# Altium schematic sheet 7_SARADC_GPIO.schdoc
size 431 x 309 mm; Symbol: Sheet-Symbol_A4; Device: Sheet-Symbol_A4; Company: 嘉立创EDA; Version: V1.0; Page Size: A4; @Project Name: RK3568核心板; @Page Count: 14; @Update Date: 2024-10-11; @Create Date: 2024-10-09; @Schematic Name: Schematic1; @Page No: 7; @Page Name: SARADC/GPIO; @Board Name: Board1; @Create Time: 17:26:00; @Update Time: 10:52:44; Width: 1655; Height: 1170; Region Start: 1; X Region Count: 6; Y Region Count: 4; Blade Width: 10; Title Block Position: 3
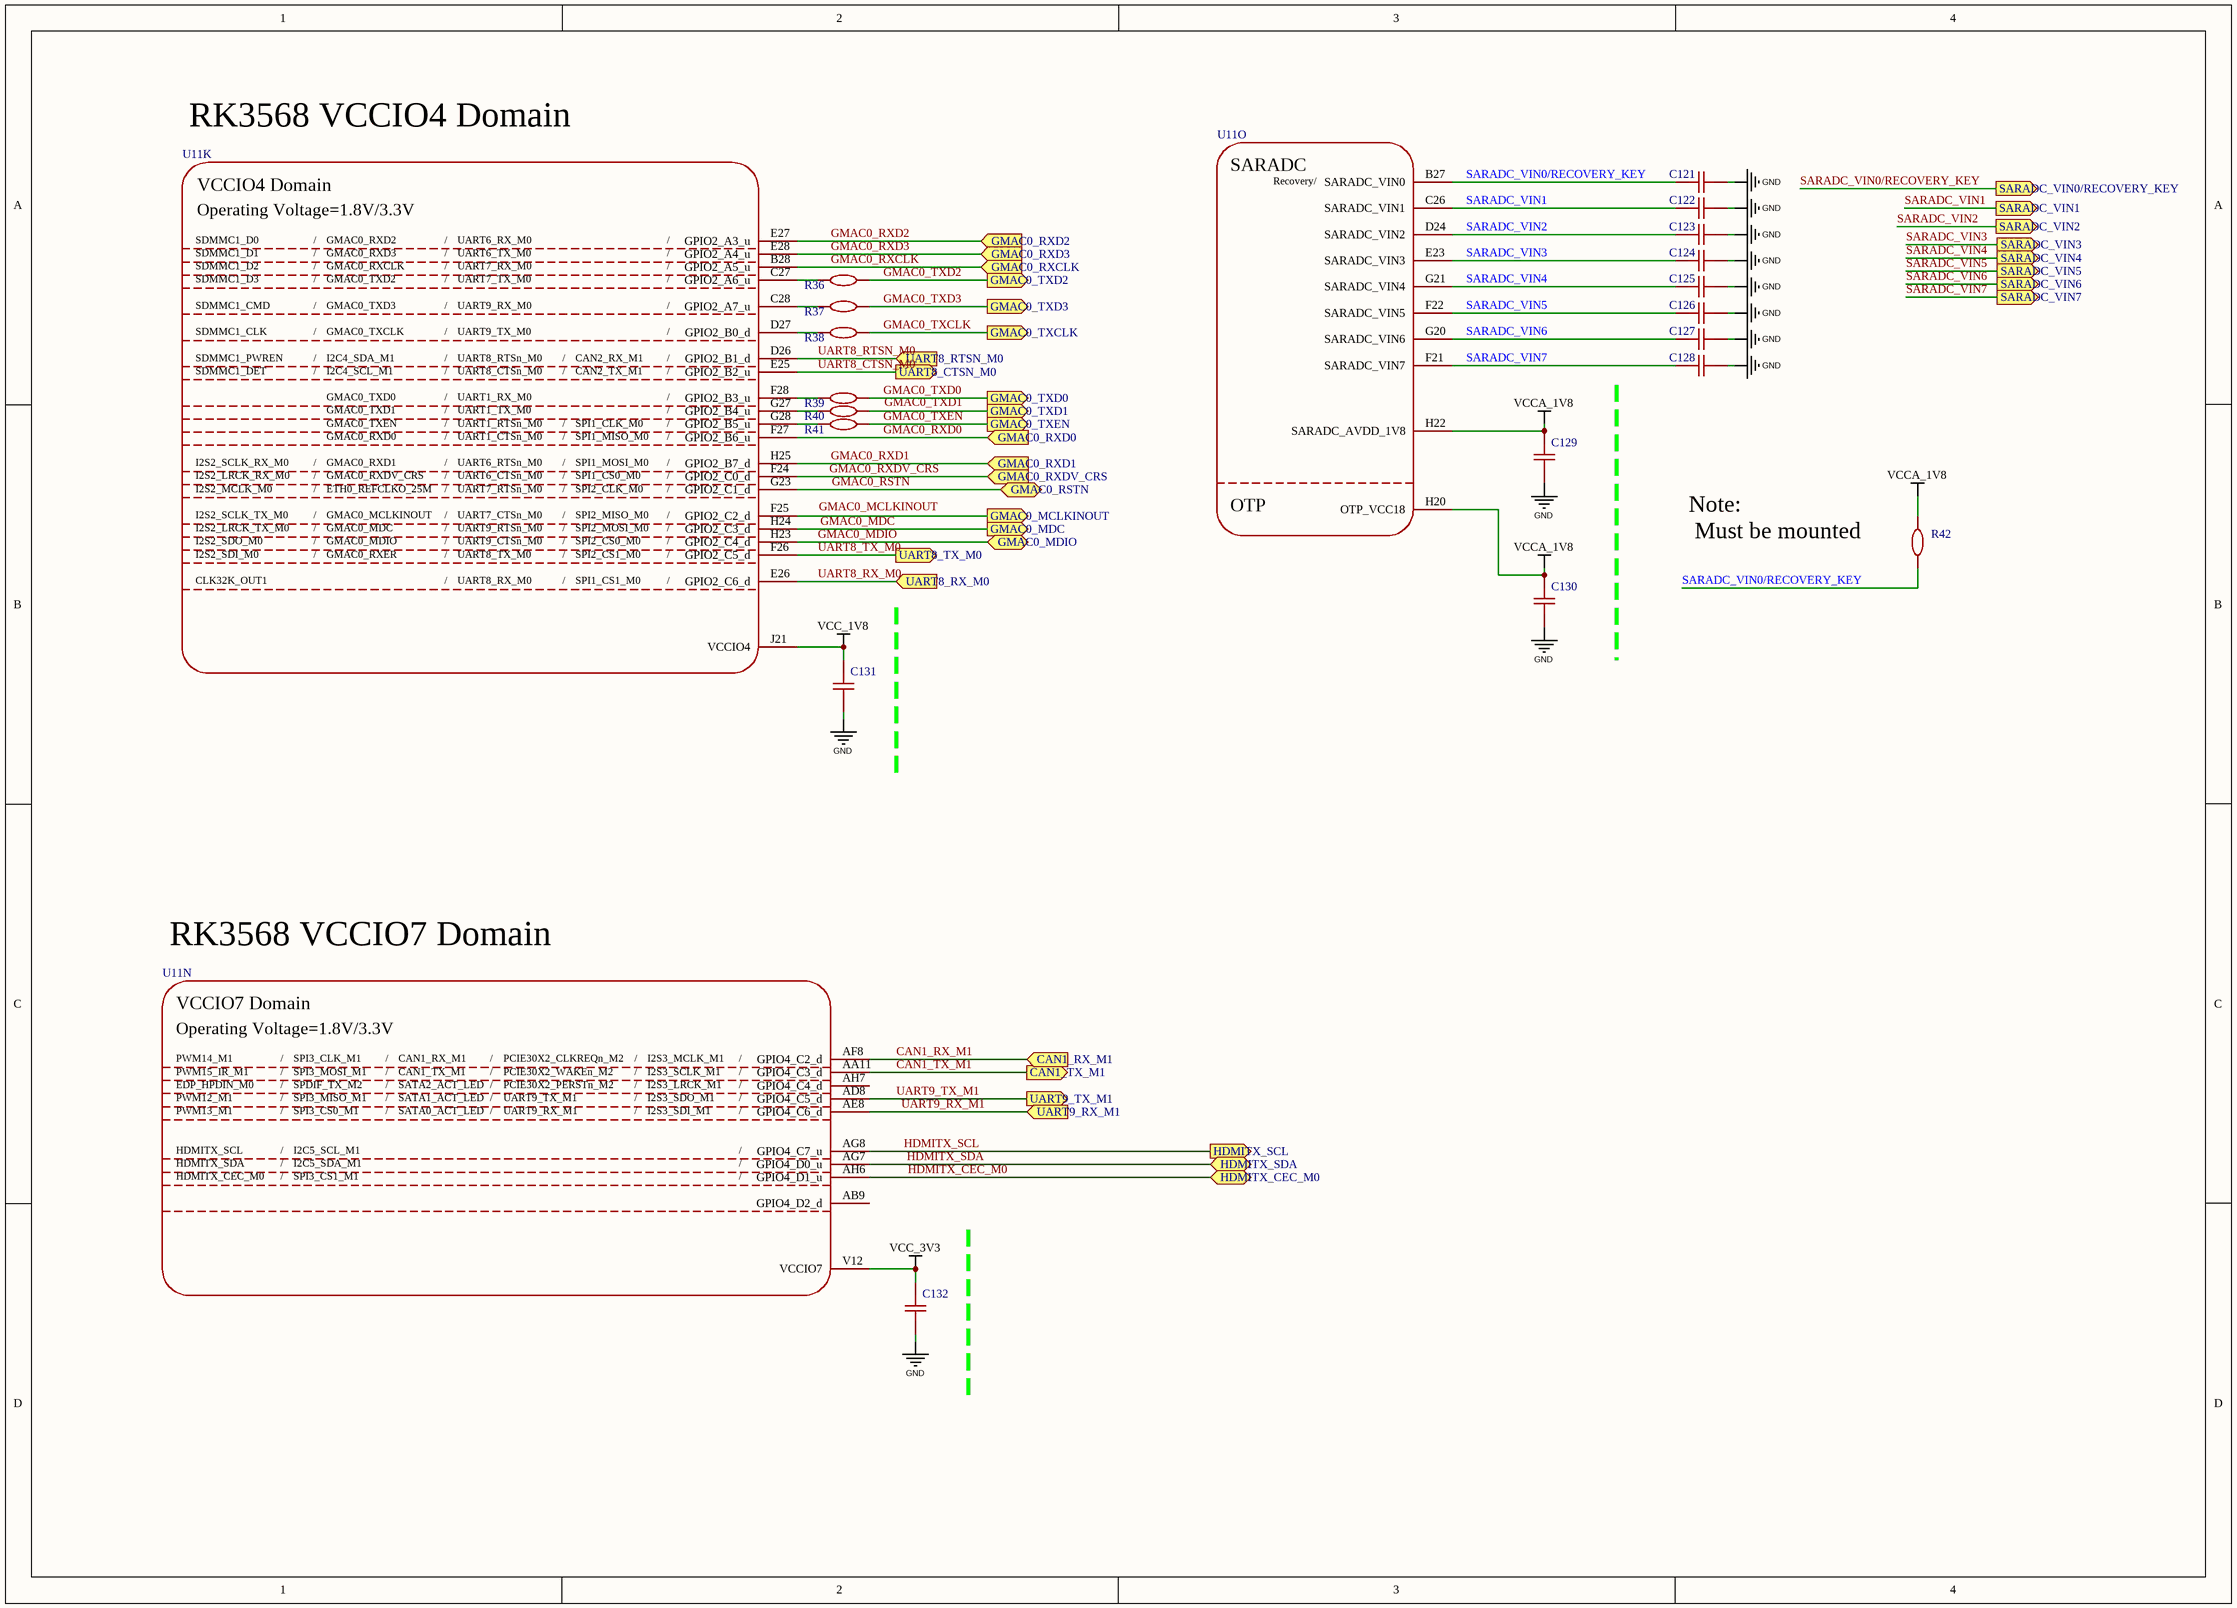
[diagram p0: 7_SARADC_GPIO.schdoc]

## Parts
C121  1nF  [C0201]  (value not drawn)
C122  1nF  [C0201]  (value not drawn)
C123  1nF  [C0201]  (value not drawn)
C124  1nF  [C0201]  (value not drawn)
C125  1nF  [C0201]  (value not drawn)
C126  1nF  [C0201]  (value not drawn)
C127  1nF  [C0201]  (value not drawn)
C128  1nF  [C0201]  (value not drawn)
C129  100nF  [C0201]  (value not drawn)
C130  100nF  [C0201]  (value not drawn)
C131  100nF  [C0201]  (value not drawn)
C132  100nF  [C0201]  (value not drawn)
R36  22Ω  [R0201]  (value not drawn)
R37  22Ω  [R0201]  (value not drawn)
R38  22Ω  [R0201]  (value not drawn)
R39  22Ω  [R0201]  (value not drawn)
R40  22Ω  [R0201]  (value not drawn)
R41  22Ω  [R0201]  (value not drawn)
R42  10kΩ  [R0402]  (value not drawn)
U11  SOC_RK3568  [RK3568]  (value not drawn)  (parts K,N,O of 23)

## Ports
CAN1_RX_M1 (in), CAN1_TX_M1 (out), GMAC0_MCLKINOUT (out), GMAC0_MDC (out), GMAC0_MDIO (bidir), GMAC0_RSTN (bidir), GMAC0_RXCLK (in), GMAC0_RXD0 (in), GMAC0_RXD1 (in), GMAC0_RXD2 (in), GMAC0_RXD3 (in), GMAC0_RXDV_CRS (in), GMAC0_TXCLK (out), GMAC0_TXD0 (out), GMAC0_TXD1 (out), GMAC0_TXD2 (out), GMAC0_TXD3 (out), GMAC0_TXEN (out), HDMITX_CEC_M0 (bidir), HDMITX_SCL (out), HDMITX_SDA (bidir), SARADC_VIN0/RECOVERY_KEY (out), SARADC_VIN1 (out), SARADC_VIN2 (out), SARADC_VIN3 (out), SARADC_VIN4 (out), SARADC_VIN5 (out), SARADC_VIN6 (out), SARADC_VIN7 (out), UART8_CTSN_M0 (out), UART8_RTSN_M0 (in), UART8_RX_M0 (in), UART8_TX_M0 (out), UART9_RX_M1 (in), UART9_TX_M1 (out)

## Nets
GND: C121.1 C122.1 C123.1 C124.1 C125.1 C126.1 C127.1 C128.1 C129.1 C130.1 C131.1 C132.1
VCC_1V8: C131.2 U11.J21(VCCIO4)
VCC_3V3: C132.2 U11.V12(VCCIO7)
VCCA_1V8: C129.2 C130.2 R42.2 U11.H20(OTP_VCC18) U11.H22(SARADC_AVDD_1V8)
CAN1_RX_M1: U11.AF8(GPIO4_C2_d) ; port CAN1_RX_M1
CAN1_TX_M1: U11.AA11(GPIO4_C3_d) ; port CAN1_TX_M1
GMAC0_MCLKINOUT: U11.F25(GPIO2_C2_d) ; port GMAC0_MCLKINOUT
GMAC0_MDC: U11.H24(GPIO2_C3_d) ; port GMAC0_MDC
GMAC0_MDIO: U11.H23(GPIO2_C4_d) ; port GMAC0_MDIO
GMAC0_RSTN: U11.G23(GPIO2_C1_d) ; port GMAC0_RSTN
GMAC0_RXCLK: U11.B28(GPIO2_A5_u) ; port GMAC0_RXCLK
GMAC0_RXD0: U11.F27(GPIO2_B6_u) ; port GMAC0_RXD0
GMAC0_RXD1: U11.H25(GPIO2_B7_d) ; port GMAC0_RXD1
GMAC0_RXD2: U11.E27(GPIO2_A3_u) ; port GMAC0_RXD2
GMAC0_RXD3: U11.E28(GPIO2_A4_u) ; port GMAC0_RXD3
GMAC0_RXDV_CRS: U11.F24(GPIO2_C0_d) ; port GMAC0_RXDV_CRS
GMAC0_TXCLK: R38.2 ; port GMAC0_TXCLK
GMAC0_TXD0: R39.2 ; port GMAC0_TXD0
GMAC0_TXD1: R40.2 ; port GMAC0_TXD1
GMAC0_TXD2: R36.2 ; port GMAC0_TXD2
GMAC0_TXD3: R37.2 ; port GMAC0_TXD3
GMAC0_TXEN: R41.2 ; port GMAC0_TXEN
HDMITX_CEC_M0: U11.AH6(GPIO4_D1_u) ; port HDMITX_CEC_M0
HDMITX_SCL: U11.AG8(GPIO4_C7_u) ; port HDMITX_SCL
HDMITX_SDA: U11.AG7(GPIO4_D0_u) ; port HDMITX_SDA
SARADC_VIN0/RECOVERY_KEY: C121.2 R42.1 U11.B27(SARADC_VIN0) ; port SARADC_VIN0/RECOVERY_KEY
SARADC_VIN1: C122.2 U11.C26(SARADC_VIN1) ; port SARADC_VIN1
SARADC_VIN2: C123.2 U11.D24(SARADC_VIN2) ; port SARADC_VIN2
SARADC_VIN3: C124.2 U11.E23(SARADC_VIN3) ; port SARADC_VIN3
SARADC_VIN4: C125.2 U11.G21(SARADC_VIN4) ; port SARADC_VIN4
SARADC_VIN5: C126.2 U11.F22(SARADC_VIN5) ; port SARADC_VIN5
SARADC_VIN6: C127.2 U11.G20(SARADC_VIN6) ; port SARADC_VIN6
SARADC_VIN7: C128.2 U11.F21(SARADC_VIN7) ; port SARADC_VIN7
UART8_CTSN_M0: U11.E25(GPIO2_B2_u) ; port UART8_CTSN_M0
UART8_RTSN_M0: U11.D26(GPIO2_B1_d) ; port UART8_RTSN_M0
UART8_RX_M0: U11.E26(GPIO2_C6_d) ; port UART8_RX_M0
UART8_TX_M0: U11.F26(GPIO2_C5_d) ; port UART8_TX_M0
UART9_RX_M1: U11.AE8(GPIO4_C6_d) ; port UART9_RX_M1
UART9_TX_M1: U11.AD8(GPIO4_C5_d) ; port UART9_TX_M1
NetR36_1: R36.1 U11.C27(GPIO2_A6_u)
NetR37_1: R37.1 U11.C28(GPIO2_A7_u)
NetR38_1: R38.1 U11.D27(GPIO2_B0_d)
NetR39_1: R39.1 U11.F28(GPIO2_B3_u)
NetR40_1: R40.1 U11.G27(GPIO2_B4_u)
NetR41_1: R41.1 U11.G28(GPIO2_B5_u)

Not connected (* = marked no-connect by the designer): U11 AB9(GPIO4_D2_d) AH7(GPIO4_C4_d)

## Notes on the sheet
- RK3568 VCCIO4 Domain
- Note:
  Must be mounted
- RK3568 VCCIO7 Domain
- Labels drawn without touching a wire or pin: GMAC0_MCLKINOUT, GMAC0_TXD1
- 1
- 2
- 3
- 4
- 5
- 6
- A
- B
- C
- D
- 原理图
- Schematic1
- 创建日期
- 更新日期
- 2024-10-11
- 2024-10-09
- 审阅
- 绘制
- 图页
- SARADC/GPIO
- 物料编码
- RK3568核心板
- 版本
- 尺寸
- 页
- 7
- 共
- 14
- V1.0
- A4
- 嘉立创EDA
- (in symbol SOC_RK3568, part K) VCCIO4 Domain; Operating Voltage=1.8V/3.3V; SDMMC1_D0; /; GMAC0_RXD2; UART6_RX_M0; SDMMC1_D1; GMAC0_RXD3; UART6_TX_M0; SDMMC1_D2; GMAC0_RXCLK; UART7_RX_M0; SDMMC1_D3; GMAC0_TXD2; UART7_TX_M0; SDMMC1_CMD; GMAC0_TXD3; UART9_RX_M0; SDMMC1_CLK; GMAC0_TXCLK; UART9_TX_M0; SDMMC1_PWREN; I2C4_SDA_M1; UART8_RTSn_M0; CAN2_RX_M1; SDMMC1_DET; I2C4_SCL_M1; UART8_CTSn_M0; CAN2_TX_M1; GMAC0_TXD0; UART1_RX_M0; GMAC0_TXD1; UART1_TX_M0; GMAC0_TXEN; UART1_RTSn_M0; SPI1_CLK_M0; GMAC0_RXD0; UART1_CTSn_M0; SPI1_MISO_M0; I2S2_SCLK_RX_M0; GMAC0_RXD1; UART6_RTSn_M0; SPI1_MOSI_M0; I2S2_LRCK_RX_M0; GMAC0_RXDV_CRS; UART6_CTSn_M0; SPI1_CS0_M0; I2S2_MCLK_M0; ETH0_REFCLKO_25M; UART7_RTSn_M0; SPI2_CLK_M0; I2S2_SCLK_TX_M0; GMAC0_MCLKINOUT; UART7_CTSn_M0; SPI2_MISO_M0; I2S2_LRCK_TX_M0; GMAC0_MDC; UART9_RTSn_M0; SPI2_MOSI_M0; I2S2_SDO_M0; GMAC0_MDIO; UART9_CTSn_M0; SPI2_CS0_M0; I2S2_SDI_M0; GMAC0_RXER; UART8_TX_M0; SPI2_CS1_M0; CLK32K_OUT1; UART8_RX_M0; SPI1_CS1_M0
- (in symbol SOC_RK3568, part N) VCCIO7 Domain; Operating Voltage=1.8V/3.3V; PWM14_M1; /; SPI3_CLK_M1; CAN1_RX_M1; PCIE30X2_CLKREQn_M2; I2S3_MCLK_M1; PWM15_IR_M1; SPI3_MOSI_M1; CAN1_TX_M1; PCIE30X2_WAKEn_M2; I2S3_SCLK_M1; EDP_HPDIN_M0; SPDIF_TX_M2; SATA2_ACT_LED; PCIE30X2_PERSTn_M2; I2S3_LRCK_M1; PWM12_M1; SPI3_MISO_M1; SATA1_ACT_LED; UART9_TX_M1; I2S3_SDO_M1; PWM13_M1; SPI3_CS0_M1; SATA0_ACT_LED; UART9_RX_M1; I2S3_SDI_M1; HDMITX_SCL; I2C5_SCL_M1; HDMITX_SDA; I2C5_SDA_M1; HDMITX_CEC_M0; SPI3_CS1_M1
- (in symbol SOC_RK3568, part O) SARADC; Recovery/; OTP

## Library data of the parts
C121-C128 = CC0201KRX7R9BB102: 容值:1nF;精度:±10%;额定电压:50V;材质(温度系数):X7R;; Manufacturer: YAGEO(国巨); Add into BOM: yes; Tolerance: ±10%; Voltage Rated: 50V; Temperature Coefficient: X7R; Symbol: CC0201KRX7R9BB102; Device: CC0201KRX7R9BB102; Supplier: LCSC; Supplier Part: C505464; Manufacturer Part: CC0201KRX7R9BB102; Value: 1nF; JLCPCB Part Class: 扩展库; LCSC Part Name: 1nF ±10% 50V; Supplier Footprint: 0201; Datasheet: https://atta.szlcsc.com/upload/public/pdf/source/20181031/C326875_043F02B1EACFDAD309CBED779E5C313D.pdf; Convert to PCB: yes
C129-C132 = CL03A104KO3NNNC: 容值:100nF;精度:±10%;额定电压:16V;材质(温度系数):X5R;; Manufacturer: SAMSUNG(三星); Add into BOM: yes; Tolerance: ±10%; Voltage Rated: 16V; Temperature Coefficient: X5R; Symbol: CL03A104KO3NNNC; Device: CL03A104KO3NNNC; LCSC Part Name: 100nF ±10% 16V; Supplier Part: C307380; Manufacturer Part: CL03A104KO3NNNC; Supplier Footprint: 0201; JLCPCB Part Class: 扩展库; Datasheet: https://atta.szlcsc.com/upload/public/pdf/source/20160218/1457707763339.pdf; Supplier: LCSC; Convert to PCB: yes; Value: 100nF
R36-R41 = 0201WMF220JTEE: 电阻类型:厚膜电阻;阻值:22Ω;精度:±1%;功率:50mW;最大工作电压:25V;温度系数:±200ppm/℃;; Manufacturer: UNI-ROYAL(厚声); Add into BOM: yes; Tolerance: ±1%; Power(Watts): 50mW; Overload Voltage (Max): 25V; Symbol: 0201WMF220JTEE; Device: 0201WMF220JTEE; Supplier: LCSC; Supplier Part: C270355; Manufacturer Part: 0201WMF220JTEE; Value: 22Ω; JLCPCB Part Class: 扩展库; LCSC Part Name: 22Ω ±1% 50mW 厚膜电阻; Supplier Footprint: 0201; Datasheet: https://atta.szlcsc.com/upload/public/pdf/source/20200306/C422600_1E6D84923E4A46A82E41ADD87F860B5C.pdf; Convert to PCB: yes; Type: 厚膜电阻; Temperature Coefficient: ±200ppm/℃; Operating Temperature Range: -55℃~+155℃
R42 = 0402WGF1002TCE: 电阻类型:厚膜电阻;阻值:10kΩ;精度:±1%;功率:62.5mW;最大工作电压:50V;温度系数:±100ppm/℃;; Manufacturer: UNI-ROYAL(厚声); Add into BOM: yes; Tolerance: ±1%; Power(Watts): 62.5mW; Overload Voltage (Max): 50V; Symbol: 0402WGF1002TCE; Device: 0402WGF1002TCE; LCSC Part Name: 10kΩ ±1% 62.5mW 厚膜电阻; Supplier Part: C25744; Manufacturer Part: 0402WGF1002TCE; Supplier Footprint: 0402; JLCPCB Part Class: 基础库; Datasheet: https://atta.szlcsc.com/upload/public/pdf/source/20200306/C422600_1E6D84923E4A46A82E41ADD87F860B5C.pdf; Supplier: LCSC; Convert to PCB: yes; Type: 厚膜电阻; Value: 10kΩ; Temperature Coefficient: ±100ppm/℃; Operating Temperature Range: -55℃~+155℃
U11 = SOC_RK3568: Part Reference: U1000; Manufacturer: Rockchip (瑞芯微); PCB footprint: BGA636_19R00X19R00X1R20; SWAP_INFO: (S1+S2+S3+S4+S5+S6+S7+S8+S9+S10+S11+S12+S13+S14+S15+S16+S17+S18+S19+S20+S21+S22+S23); SPLIT_INST: TRUE; Value: RK3568; Priority: A; Add into BOM: yes; Relevance: []; Symbol: SOC_RK3568; Device: SOC_RK3568; RK PN: RK3568; Part Type: SOC; Manufacturer PN: RK3568; Created by: JJJ; Origin Footprint 2: BGA636_19R00X19R00X1R20; Convert to PCB: yes